# Altium schematic sheet signal processor of UAV.SchDoc
size A4
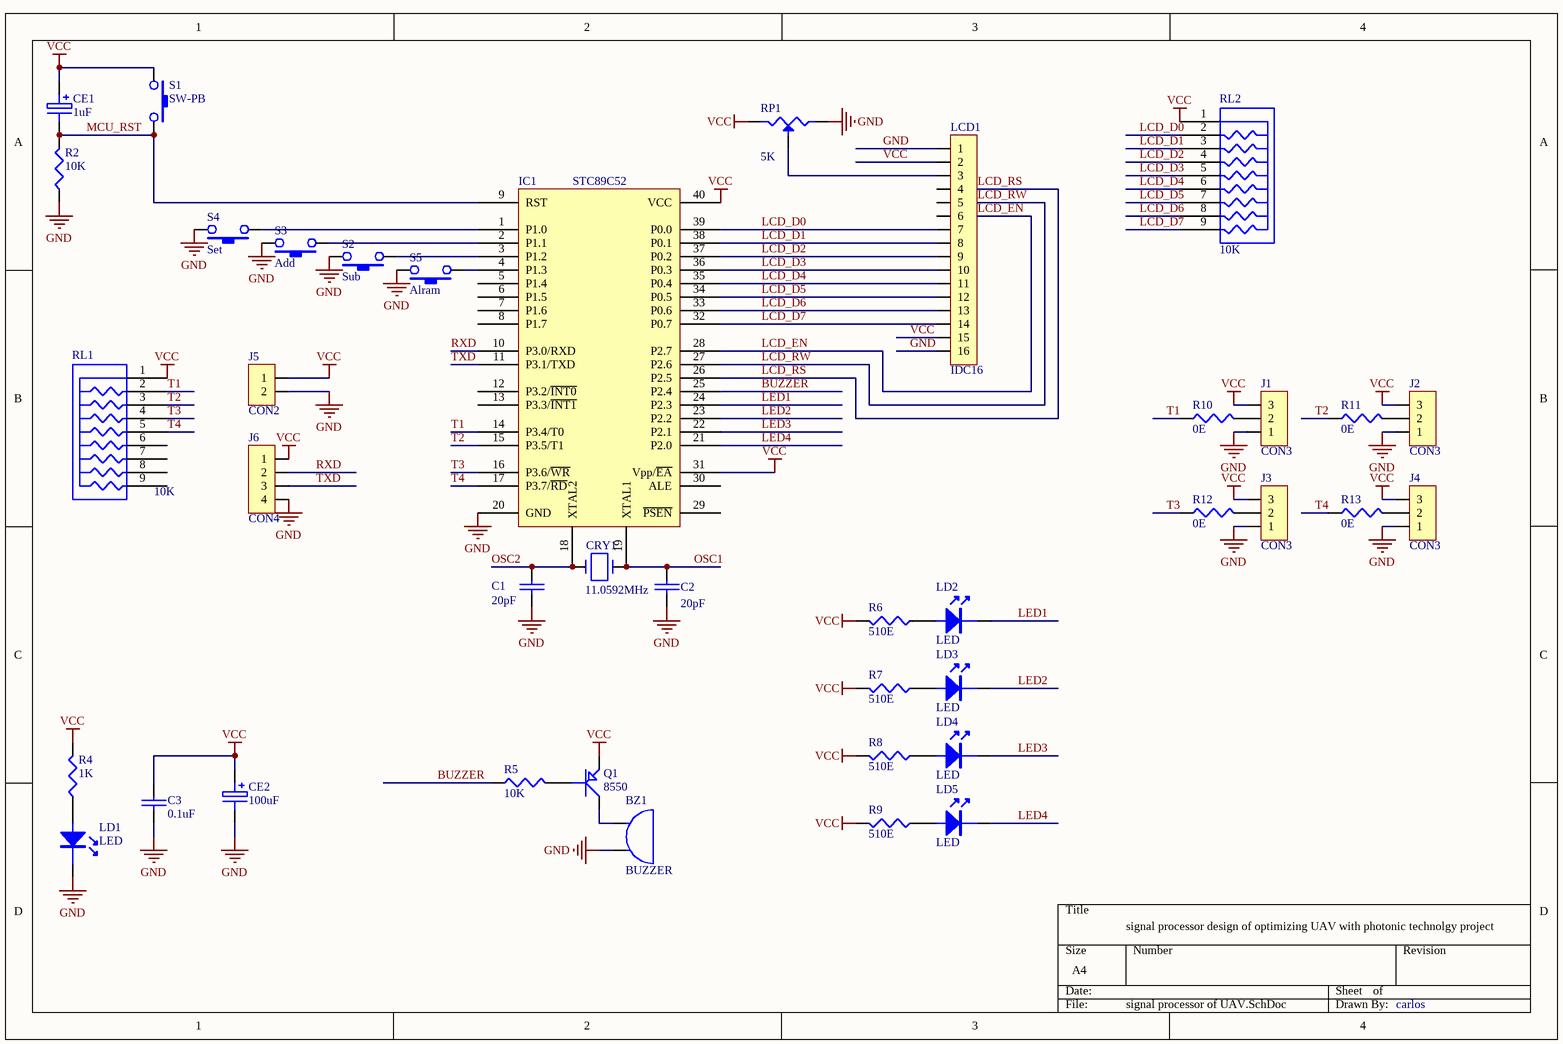
[diagram p0: signal processor of UAV.SchDoc]

## Parts
BZ1  BUZZER  [BUZZER1]
C1  20pF  [RAD0.1]
C2  20pF  [RAD0.1]
C3  0.1uF  [RAD0.1]
CE1  1uF  [RB.1/.1L]
CE2  100uF  [RB.1/.2]
CRY1  11.0592MHz  [XTAL1]
IC1  STC89C52  [DIP40]
J1  CON3  [HJ3P2.54]
J2  CON3  [HJ3P2.54]
J3  CON3  [HJ3P2.54]
J4  CON3  [HJ3P2.54]
J5  CON2  [HJ2P2.54]
J6  CON4  [HJ4P2.54]
LCD1  IDC16  [LCD1602A]
LD1  LED  [LEDF3]
LD2  LED  [LEDF3]
LD3  LED  [LEDF3]
LD4  LED  [LEDF3]
LD5  LED  [LEDF3]
Q1  8550  [TR-EBC]
R2  10K  [AXIAL0.3]
R4  1K  [AXIAL0.3]
R5  10K  [AXIAL0.3]
R6  510E  [AXIAL0.3]
R7  510E  [AXIAL0.3]
R8  510E  [AXIAL0.3]
R9  510E  [AXIAL0.3]
R10  0E  [AXIAL0.3]
R11  0E  [AXIAL0.3]
R12  0E  [AXIAL0.3]
R13  0E  [AXIAL0.3]
RL1  10K  [RES9P]
RL2  10K  [RES9P]
RP1  5K  [WR1]
S1  SW-PB  [SW-PB4DS]
S2  Sub  [SW-PB4DS]
S3  Add  [SW-PB4DS]
S4  Set  [SW-PB4DS]
S5  Alram  [SW-PB4DS]

## Nets
GND: BZ1.2 C1.2 C2.2 C3.2 CE2.2 IC1.20(GND) J1.1 J2.1 J3.1 J4.1 J5.2 J6.4 LCD1.1 LCD1.16 LD1.K R2.1 RP1.2 S2.1 S3.1 S4.1 S5.1
VCC: C3.1 CE1.1 CE2.1 IC1.31(Vpp/~{EA}) IC1.40(VCC) J1.3 J2.3 J3.3 J4.3 J5.1 J6.1 LCD1.2 LCD1.15 Q1.EMIT R4.2 R6.2 R7.2 R8.2 R9.2 RL1.1 RL2.1 RP1.1 S1.1
BUZZER: IC1.25(P2.4) R5.1
LCD_D0: IC1.39(P0.0) LCD1.7 RL2.2
LCD_D1: IC1.38(P0.1) LCD1.8 RL2.3
LCD_D2: IC1.37(P0.2) LCD1.9 RL2.4
LCD_D3: IC1.36(P0.3) LCD1.10 RL2.5
LCD_D4: IC1.35(P0.4) LCD1.11 RL2.6
LCD_D5: IC1.34(P0.5) LCD1.12 RL2.7
LCD_D6: IC1.33(P0.6) LCD1.13 RL2.8
LCD_D7: IC1.32(P0.7) LCD1.14 RL2.9
LCD_EN: IC1.28(P2.7)
LCD_RS: IC1.26(P2.5)
LCD_RW: IC1.27(P2.6)
LED1: IC1.24(P2.3) LD2.K
LED2: IC1.23(P2.2) LD3.K
LED3: IC1.22(P2.1) LD4.K
LED4: IC1.21(P2.0) LD5.K
MCU_RST: CE1.2 IC1.9(RST) R2.2 S1.2
OSC1: C2.1 CRY1.2 IC1.19(XTAL1)
OSC2: C1.1 CRY1.1 IC1.18(XTAL2)
RXD: IC1.10(P3.0/RXD) J6.2
T1: IC1.14(P3.4/T0) R10.1 RL1.2
T2: IC1.15(P3.5/T1) R11.1 RL1.3
T3: IC1.16(P3.6/~{WR}) R12.1 RL1.4
T4: IC1.17(P3.7/~{RD}) R13.1 RL1.5
TXD: IC1.11(P3.1/TXD) J6.3
NetBZ1_1: BZ1.1 Q1.COLL
NetIC1_1: IC1.1(P1.0) S4.2
NetIC1_2: IC1.2(P1.1) S3.2
NetIC1_3: IC1.3(P1.2) S2.2
NetIC1_4: IC1.4(P1.3) S5.2
NetJ1_2: J1.2 R10.2
NetJ2_2: J2.2 R11.2
NetJ3_2: J3.2 R12.2
NetJ4_2: J4.2 R13.2
NetLCD1_3: LCD1.3 RP1.W
NetLD1_A: LD1.A R4.1
NetLD2_A: LD2.A R6.1
NetLD3_A: LD3.A R7.1
NetLD4_A: LD4.A R8.1
NetLD5_A: LD5.A R9.1
NetQ1_BASE: Q1.BASE R5.2

Not connected (* = marked no-connect by the designer): IC1 5(P1.4) 6(P1.5) 7(P1.6) 8(P1.7) 12(P3.2/~{INT0}) 13(P3.3/~{INT1}) 29(~{PSEN}) 30(ALE); LCD1 4 5 6; RL1 6 7 8 9

## Notes on the sheet
- signal processor design of optimizing UAV with photonic technolgy project
- carlos

## Library data of the parts
C1 C2 = CAP: Capacitor
C3 = CAP
CE1 CE2 = ELECTRO1
CRY1 = CRYSTAL
IC1 = AT89C51
LCD1 = CON16
Q1 = pnp1
R2 R4-R13 = RES1
RL1 RL2 = RESL1
RP1 = Pot1
S2-S5 = SW-PB